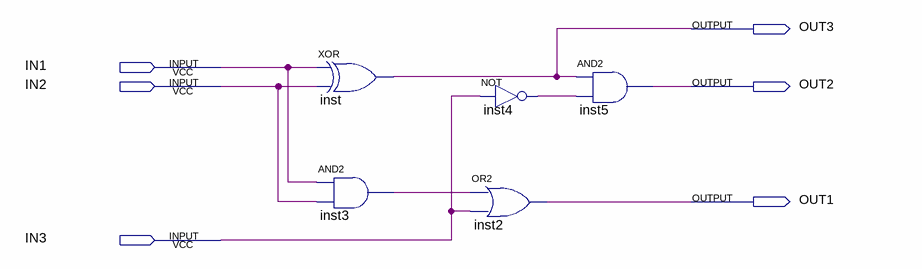
[diagram p0: schematic sheet]
// Quartus schematic exercicio.bdf as structural Verilog: 5 symbols, 6 pins
module exercicio (
  input  IN1,
  input  IN2,
  input  IN3,
  output OUT3,
  output OUT2,
  output OUT1
);

  wire inst3_out, inst4_out;

  xor inst (OUT3, IN1, IN2);
  and inst3 (inst3_out, IN1, IN2);
  not inst4 (inst4_out, IN3);
  or inst2 (OUT1, inst3_out, IN3);
  and inst5 (OUT2, OUT3, inst4_out);
endmodule
